# Altium schematic sheet 06_POWER_2.SchDoc
size 420 x 297 mm; SheetNumber: 8; SheetTotal: 35
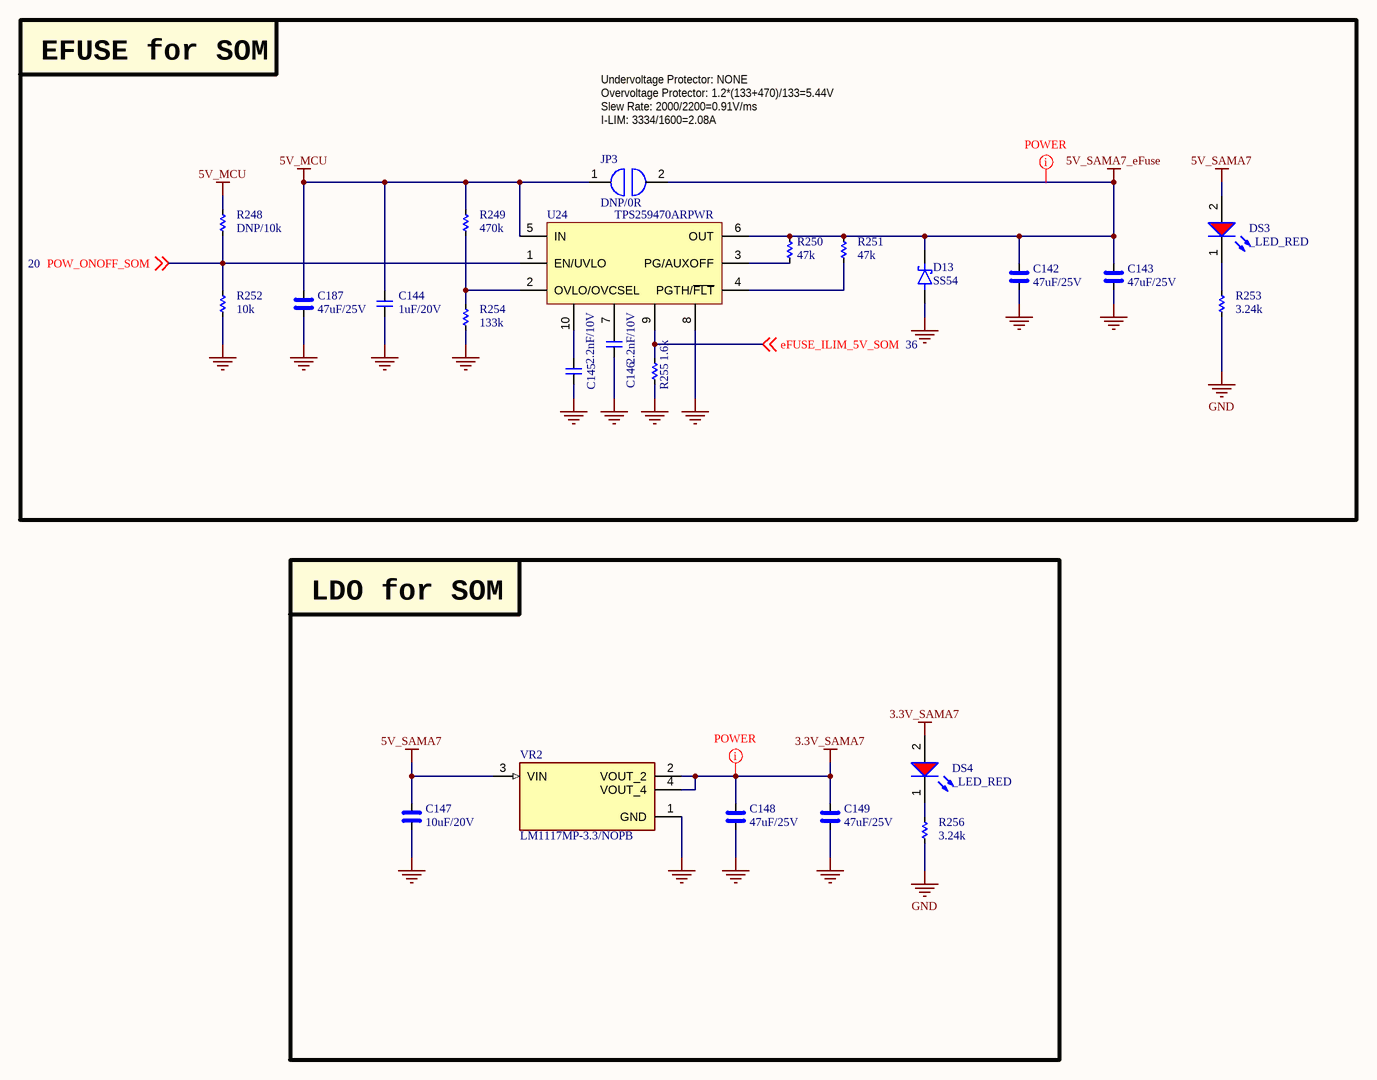
[diagram p0: 06_POWER_2.SchDoc]

## Parts
C142  47uF/25V  [CAP_C_3225X80]
C143  47uF/25V  [CAP_C_3225X80]
C144  1uF/20V  [CAP_C_1005X60]
C145  2.2nF/10V  [CAP_C_1005X60]
C146  2.2nF/10V  [CAP_C_1005X60]
C147  10uF/20V  [CAP_C_2012X110]
C148  47uF/25V  [CAP_C_3225X80]
C149  47uF/25V  [CAP_C_3225X80]
C187  47uF/25V  [CAP_C_3225X80]
D13  SS54  [DO-214AC_SMA]
DS3  _LED_RED  [LED_0603]
DS4  _LED_RED  [LED_0603]
JP3  DNP/0R  [JUMPER_1608]
R248  DNP/10k  [RES_C_1005X40]
R249  470k  [RES_C_1005X40]
R250  47k  [RES_C_1005X40]
R251  47k  [RES_C_1005X40]
R252  10k  [RES_C_1005X40]
R253  3.24k  [RES_C_1005X40]
R254  133k  [RES_C_1005X40]
R255  1.6k  [RES_C_1005X40]
R256  3.24k  [RES_C_1005X40]
U24  TPS259470ARPWR  [VQFN-HR-10]
VR2  LM1117MP-3.3/NOPB  [VREG_LM1117MP-3.3/NOPB]

## Blocks framed on the sheet
EFUSE for SOM: C142-C146 C187 D13 DS3 JP3 R248-R255 U24
LDO for SOM: C147-C149 DS4 R256 VR2

## Nets
3.3V_SAMA7: C148.2 C149.2 DS4.2(A) VR2.2(VOUT_2) VR2.4(VOUT_4)
5V_MCU: C144.2 C187.2 JP3.1 R248.1 R249.2 U24.5(IN)
5V_SAMA7: C147.1 DS3.2(A) VR2.3(VIN)
5V_SAMA7_eFuse: C142.2 C143.2 D13.1(K) JP3.2 R250.2 R251.2 U24.6(OUT)
GND: C142.1 C143.1 C144.1 C145.1 C146.1 C147.2 C148.1 C149.1 C187.1 D13.2(A) R252.2 R253.1 R254.1 R255.1 R256.1 U24.8 VR2.1(GND)
eFUSE_ILIM_5V_SOM: R255.2 U24.9 ; off-sheet eFUSE_ILIM_5V_SOM
POW_ONOFF_SOM: R248.2 R252.1 U24.1(EN/UVLO) ; off-sheet POW_ONOFF_SOM
NetC145_2: C145.2 U24.10
NetC146_2: C146.2 U24.7
NetDS3_1: DS3.1(K) R253.2
NetDS4_1: DS4.1(K) R256.2
NetR249_1: R249.1 R254.2 U24.2(OVLO/OVCSEL)
NetR250_1: R250.1 U24.3(PG/AUXOFF)
NetR251_1: R251.1 U24.4(PGTH/~{FLT})

## Layout directives
net class POWER: 3.3V_SAMA7, 5V_SAMA7_eFuse

## Notes on the sheet
- Undervoltage Protector: NONE
- Overvoltage Protector: 1.2*(133+470)/133=5.44V
- Slew Rate: 2000/2200=0.91V/ms
- I-LIM: 3334/1600=2.08A
- Project:
- Sub-system:
- Design by:
- Sheet title:
- Sheet
- of
- Checked by:
- Approved by:
- Revision:
- Document No:
- Size:
- Date:
- A3

## Library data of the parts
C142 C143 C147-C149 C187 = _CAP_C_High_2: CAP High Value
C144-C146 = _CAP_C_2: CAP
D13 = DIODE SCHOTTKY
JP3 = JUMPER
R248-R256 = _RES_B_2: RES
VR2 = LM1117MP-3.3/NOPB: 800-mA 15-V linear voltage regulator; MF: Texas Instruments; SnapEDA_Link: https://www.snapeda.com/parts/LM1117MP-3.3/NOPB/Texas+Instruments/view-part/?ref=snap; Package: SOT-223-4 Texas Instruments; Value: *; MP: LM1117MP-3.3/NOPB; Check_prices: https://www.snapeda.com/parts/LM1117MP-3.3/NOPB/Texas+Instruments/view-part/?ref=eda